# EAGLE design sensor (EAGLE 9.5.2)
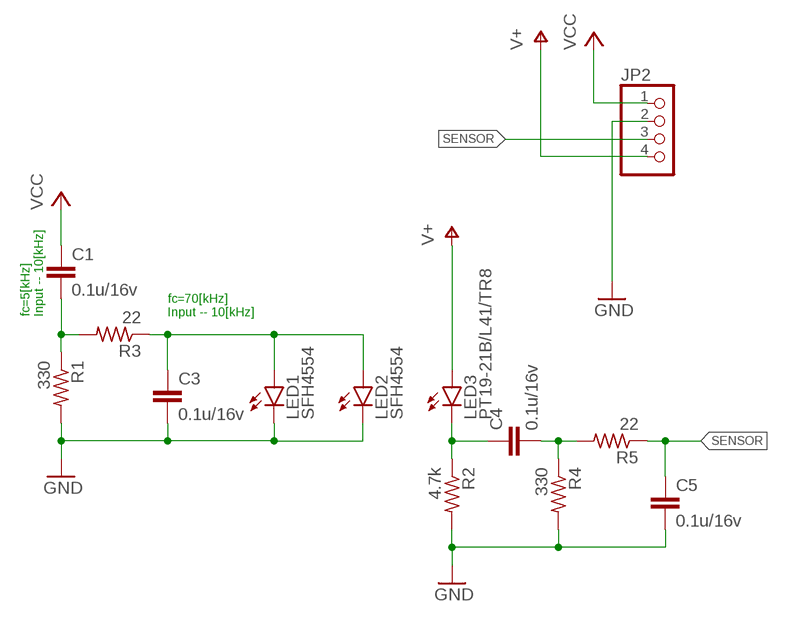
[diagram p0: schematic, sheet 1]

## Parts
C1  0.1u/16v  C-EUC0603  [C0603]
C3  0.1u/16v  C-EUC0603  [C0603]
C4  0.1u/16v  C-EUC0603  [C0603]
C5  0.1u/16v  C-EUC0603  [C0603]
JP2  PINHD-1X4/90  [1X04/90]
LED1  SFH4554  LED5MM  [LED5MM]
LED2  SFH4554  LED5MM  [LED5MM]
LED3  PT19-21B/L41/TR8  LEDSML0603  [SML0603]
R1  330  R-US_R0603  [R0603]
R2  4.7k  R-US_R0603  [R0603]
R3  22  R-US_R0603  [R0603]
R4  330  R-US_R0603  [R0603]
R5  22  R-US_R0603  [R0603]

## Nets
GND: C3.2 C5.2 JP2.2 LED1.K(C) LED2.K(C) R1.2 R2.2 R4.2
N$1: C3.1 LED1.A LED2.A R3.1
N$4: C4.1 LED3.C R2.1
N$5: C1.2 R1.1 R3.2
N$10: C4.2 R4.1 R5.2
SENSOR: C5.1 JP2.3 R5.1
V+: JP2.4 LED3.A
VCC: C1.1 JP2.1

## Notes on the sheet
- fc=5[kHz]
  Input -- 10[kHz]
- fc=70[kHz]
  Input -- 10[kHz]

## Library data of the parts
C1 C3-C5 = rcl:C-EU: CAPACITOR, European symbol; SPICEPREFIX: C
JP2 = pinhead:PINHD-1X4: PIN HEADER
LED1-LED3 = led:LED: LED OSRAM: - CHIPLED LG R971, LG N971, LY N971, LG Q971, LY Q971, LO R971, LY R971 LH N974, LH R974 LS Q976, LO Q976, LY Q976 LO Q996 - Hyper CHIPLED LW Q18S LB Q993, LB Q99A, LB R99A - SideLED LS A670, LO A670, LY A670, LG A670, LP A670 LB A673, LV A673, LT A673, LW A673 LH A674 LY A675 LS A676, LA A676, LO A676, LY A676, LW A676 LS A679, LY A679, LG A679 - Hyper Micro SIDELED® LS Y876, LA Y876, LO Y876, LY Y876 LT Y87S - SmartLED LW L88C, LW L88S LB L89C, LB L89S, LG L890 LS L89K, LO L89K, LY L89K LS L896, LA L896, LO L896, LY L896 - TOPLED LS T670, LO T670, LY T670, LG T670, LP T670 LSG T670, LSP T670, LSY T670, LOP T670, LYG T670 LG T671, LOG T671, LSG T671 LB T673, LV T673, LT T673, LW T673 LH T674 LS T676, LA T676, LO T676, LY T676, LB T676, LH T676, LSB T676, LW T676 LB T67C, LV T67C, LT T67C, LS T67K, LO T67K, LY T67K, LW E67C LS E67B, LA E67B, LO E67B, LY E67B, LB E67C, LV E67C, LT E67C LW T67C LS T679, LY T679, LG T679 LS T770, LO T770, LY T770, LG T770, LP T770 LB T773, LV T773, LT T773, LW T773 LH T774 LS E675, LA E675, LY E675, LS T675 LS T776, LA T776, LO T776, LY T776, LB T776 LHGB T686 LT T68C, LB T68C - Hyper Mini TOPLED® LB M676 - Mini TOPLED Santana® LG M470 LS M47K, LO M47K, LY M47K Source: http://www.osram.convergy.de LUXEON: - LUMILED® LXK2-PW12-R00, LXK2-PW12-S00, LXK2-PW14-U00, LXK2-PW14-V00 LXK2-PM12-R00, LXK2-PM12-S00, LXK2-PM14-U00 LXK2-PE12-Q00, LXK2-PE12-R00, LXK2-PE12-S00, LXK2-PE14-T00, LXK2-PE14-U00 LXK2-PB12-K00, LXK2-PB12-L00, LXK2-PB12-M00, LXK2-PB14-N00, LXK2-PB14-P00, LXK2-PB14-Q00 LXK2-PR12-L00, LXK2-PR12-M00, LXK2-PR14-Q00, LXK2-PR14-R00 LXK2-PD12-Q00, LXK2-PD12-R00, LXK2-PD12-S00 LXK2-PH12-R00, LXK2-PH12-S00 LXK2-PL12-P00, LXK2-PL12-Q00, LXK2-PL12-R00 Source: www.luxeon.com KINGBRIGHT: KA-3528ASYC Source: www.kingbright.com
R1-R5 = rcl:R-US_: RESISTOR, American symbol; SPICEPREFIX: R

## Board
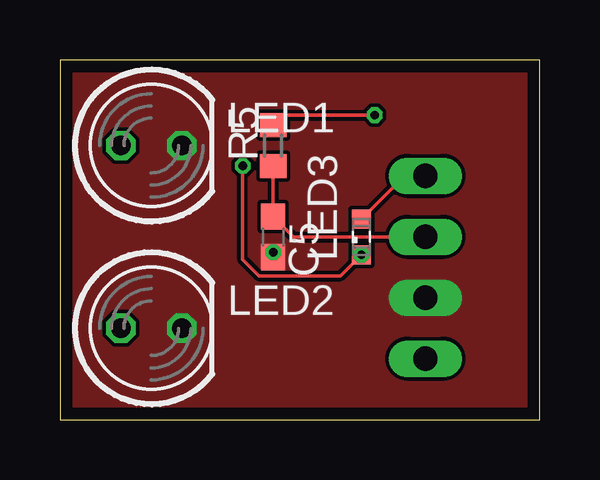
[diagram p1: board, top side]
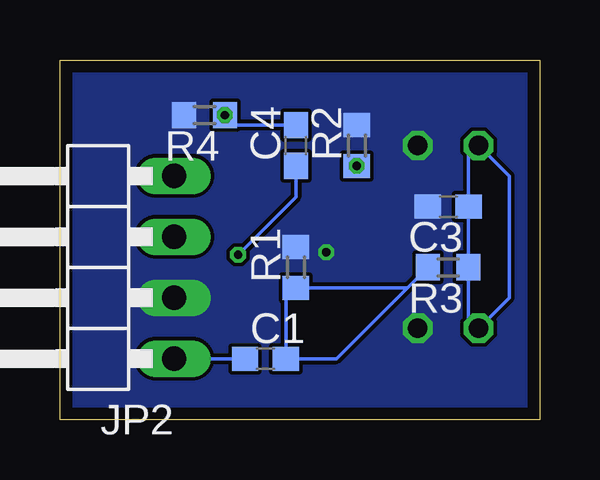
[diagram p2: board, bottom side, seen from below]

Size 20 x 15 mm. Coordinates in mm from the lower left corner, seen from the top.
Outline: 0,0 20,0 20,15 0,15 0,0
Copper layers (1*16): Top 0.035mm / dielectric 1.6mm / Bottom 0.035mm
Design rules "Elecrow_2-layer_PCB_eagle_rule": minimum track width 6mil, minimum drill 12mil, track to track 6mil, track to pad 6mil, pad to pad 6mil, via to via 8mil, smd to smd 0mil, copper to edge 20mil, drill to drill 10mil, minimum pad ring 6mil, minimum via ring 6mil, stop-mask expansion 0mil, vias tented up to drill 100mil, thermal gap 10mil

### Footprints (pad centres in the part's own frame; a part is rotated, then mirrored left to right if it is on the bottom)
C0603 = smd 1.1 x 1: 1 -0.85,0; 2 0.85,0
1X04/90 = drill 1.016 long: 1 -3.81,-3.81; 2 -1.27,-3.81; 3 1.27,-3.81; 4 3.81,-3.81
LED5MM = drill 0.813 octagon: A -1.27,0; K 1.27,0
SML0603 = smd 0.8 x 0.8: A 0.75,0; C -0.75,0
R0603 = smd 1 x 1.1: 1 -0.85,0; 2 0.85,0

### Placement (x,y rotation side)
C1  11.43,2.54 0 bottom
C3  3.81,8.89 180 bottom
C4  10.16,11.43 90 bottom
C5  8.89,7.62 270 top
JP2  19.05,6.35 90 bottom
LED1  3.81,11.43 0 top
LED2  3.81,3.81 0 top
LED3  12.57,7.62 90 top
R1  10.16,6.35 90 bottom
R2  7.62,11.43 90 bottom
R3  3.81,6.35 180 bottom
R4  13.97,12.7 180 bottom
R5  8.89,11.43 90 top

### Tracks (layer width: path | path; a pad name or v marks a point on that pad's centre or on a via)
GND  (via drill 0.35)
  other vias: 8.89,6.99
  pour Bottom (no thermals): -2.54,15.24 21.59,15.24 21.59,-2.54 -2.54,-2.54
  pour Top (no thermals): -6.35,-3.81 24.13,-3.81 24.13,17.78 -6.35,17.78
N$1
  Bottom 0.152: LED2.A 1.27,5.08 1.27,10.16 LED1.A 2.96,11.01 C3.1 R3.1 2.96,4.23 LED2.A
N$4  (via drill 0.35)
  Top 0.152: R2.1 7.62,6.67 8.29,5.99 11.69,5.99 LED3.C
  Bottom 0.152: C4.1 10.16,9.28 LED3.C
  other vias: 7.62,10.58 12.57,6.87
N$5
  Bottom 0.152: R3.2 5.51,5.5 | 5.51,5.5 R1.1 10.58,5.08 C1.2 8.47,2.54 5.51,5.5
N$10  (via drill 0.35)
  Top 0.152: R5.2 9.31,12.7 R4.1
  Bottom 0.152: C4.2 12.7,12.28 R4.1
  other vias: 13.12,12.7
SENSOR
  Top 0.152: JP2.3 9.74,7.62 C5.1 R5.1
V+
  Top 0.152: JP2.4 14.36,10.16 LED3.A
VCC
  Bottom 0.152: C1.1 JP2.1